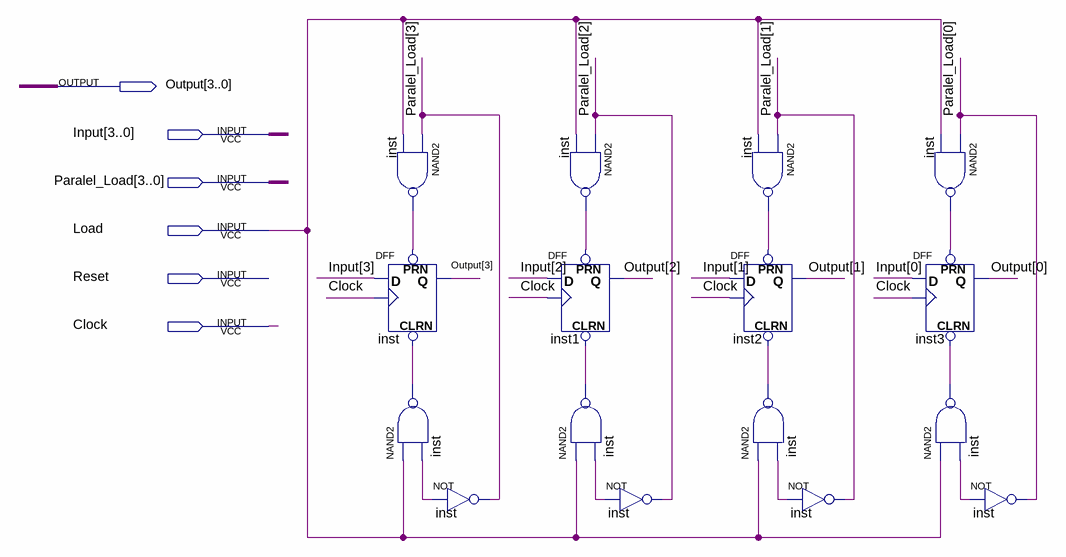
[diagram p0: schematic sheet]
// Quartus schematic Registrador_4bit.bdf as structural Verilog: 16 symbols, 6 pins
module Registrador_4bit (
  input  [3:0] Input,
  input  [3:0] Paralel_Load,
  input  Load,
  input  Reset,
  input  Clock,
  output [3:0] Output
);

  wire inst_out, inst_out_2, inst_out_3, inst_out_4, inst_out_5, inst_out_6, inst_out_7, inst_out_8,
       undriven, undriven_2, undriven_3, undriven_4;

  nand inst (inst_out, Paralel_Load[3], Load);
  DFF inst_dup2 (.CLRN(inst_out_6), .CLK(Clock), .D(Input[3]), .PRN(inst_out), .Q(Output[3]));
  nand inst_dup3 (inst_out_6, Load, undriven);
  not inst_dup4 (Paralel_Load[3], undriven);
  nand inst_dup5 (inst_out_2, Paralel_Load[2], Load);
  DFF inst1 (.CLRN(inst_out_5), .CLK(Clock), .D(Input[2]), .PRN(inst_out_2), .Q(Output[2]));
  nand inst_dup6 (inst_out_5, Load, undriven_2);
  not inst_dup7 (Paralel_Load[2], undriven_2);
  nand inst_dup8 (inst_out_3, Paralel_Load[1], Load);
  DFF inst2 (.CLRN(inst_out_4), .CLK(Clock), .D(Input[1]), .PRN(inst_out_3), .Q(Output[1]));
  nand inst_dup9 (inst_out_4, Load, undriven_3);
  not inst_dup10 (Paralel_Load[1], undriven_3);
  nand inst_dup11 (inst_out_7, Paralel_Load[0], Load);
  DFF inst3 (.CLRN(inst_out_8), .CLK(Clock), .D(Input[0]), .PRN(inst_out_7), .Q(Output[0]));
  nand inst_dup12 (inst_out_8, Load, undriven_4);
  not inst_dup13 (Paralel_Load[0], undriven_4);
endmodule
